# EAGLE board Arm Board (EAGLE 6.5.0)
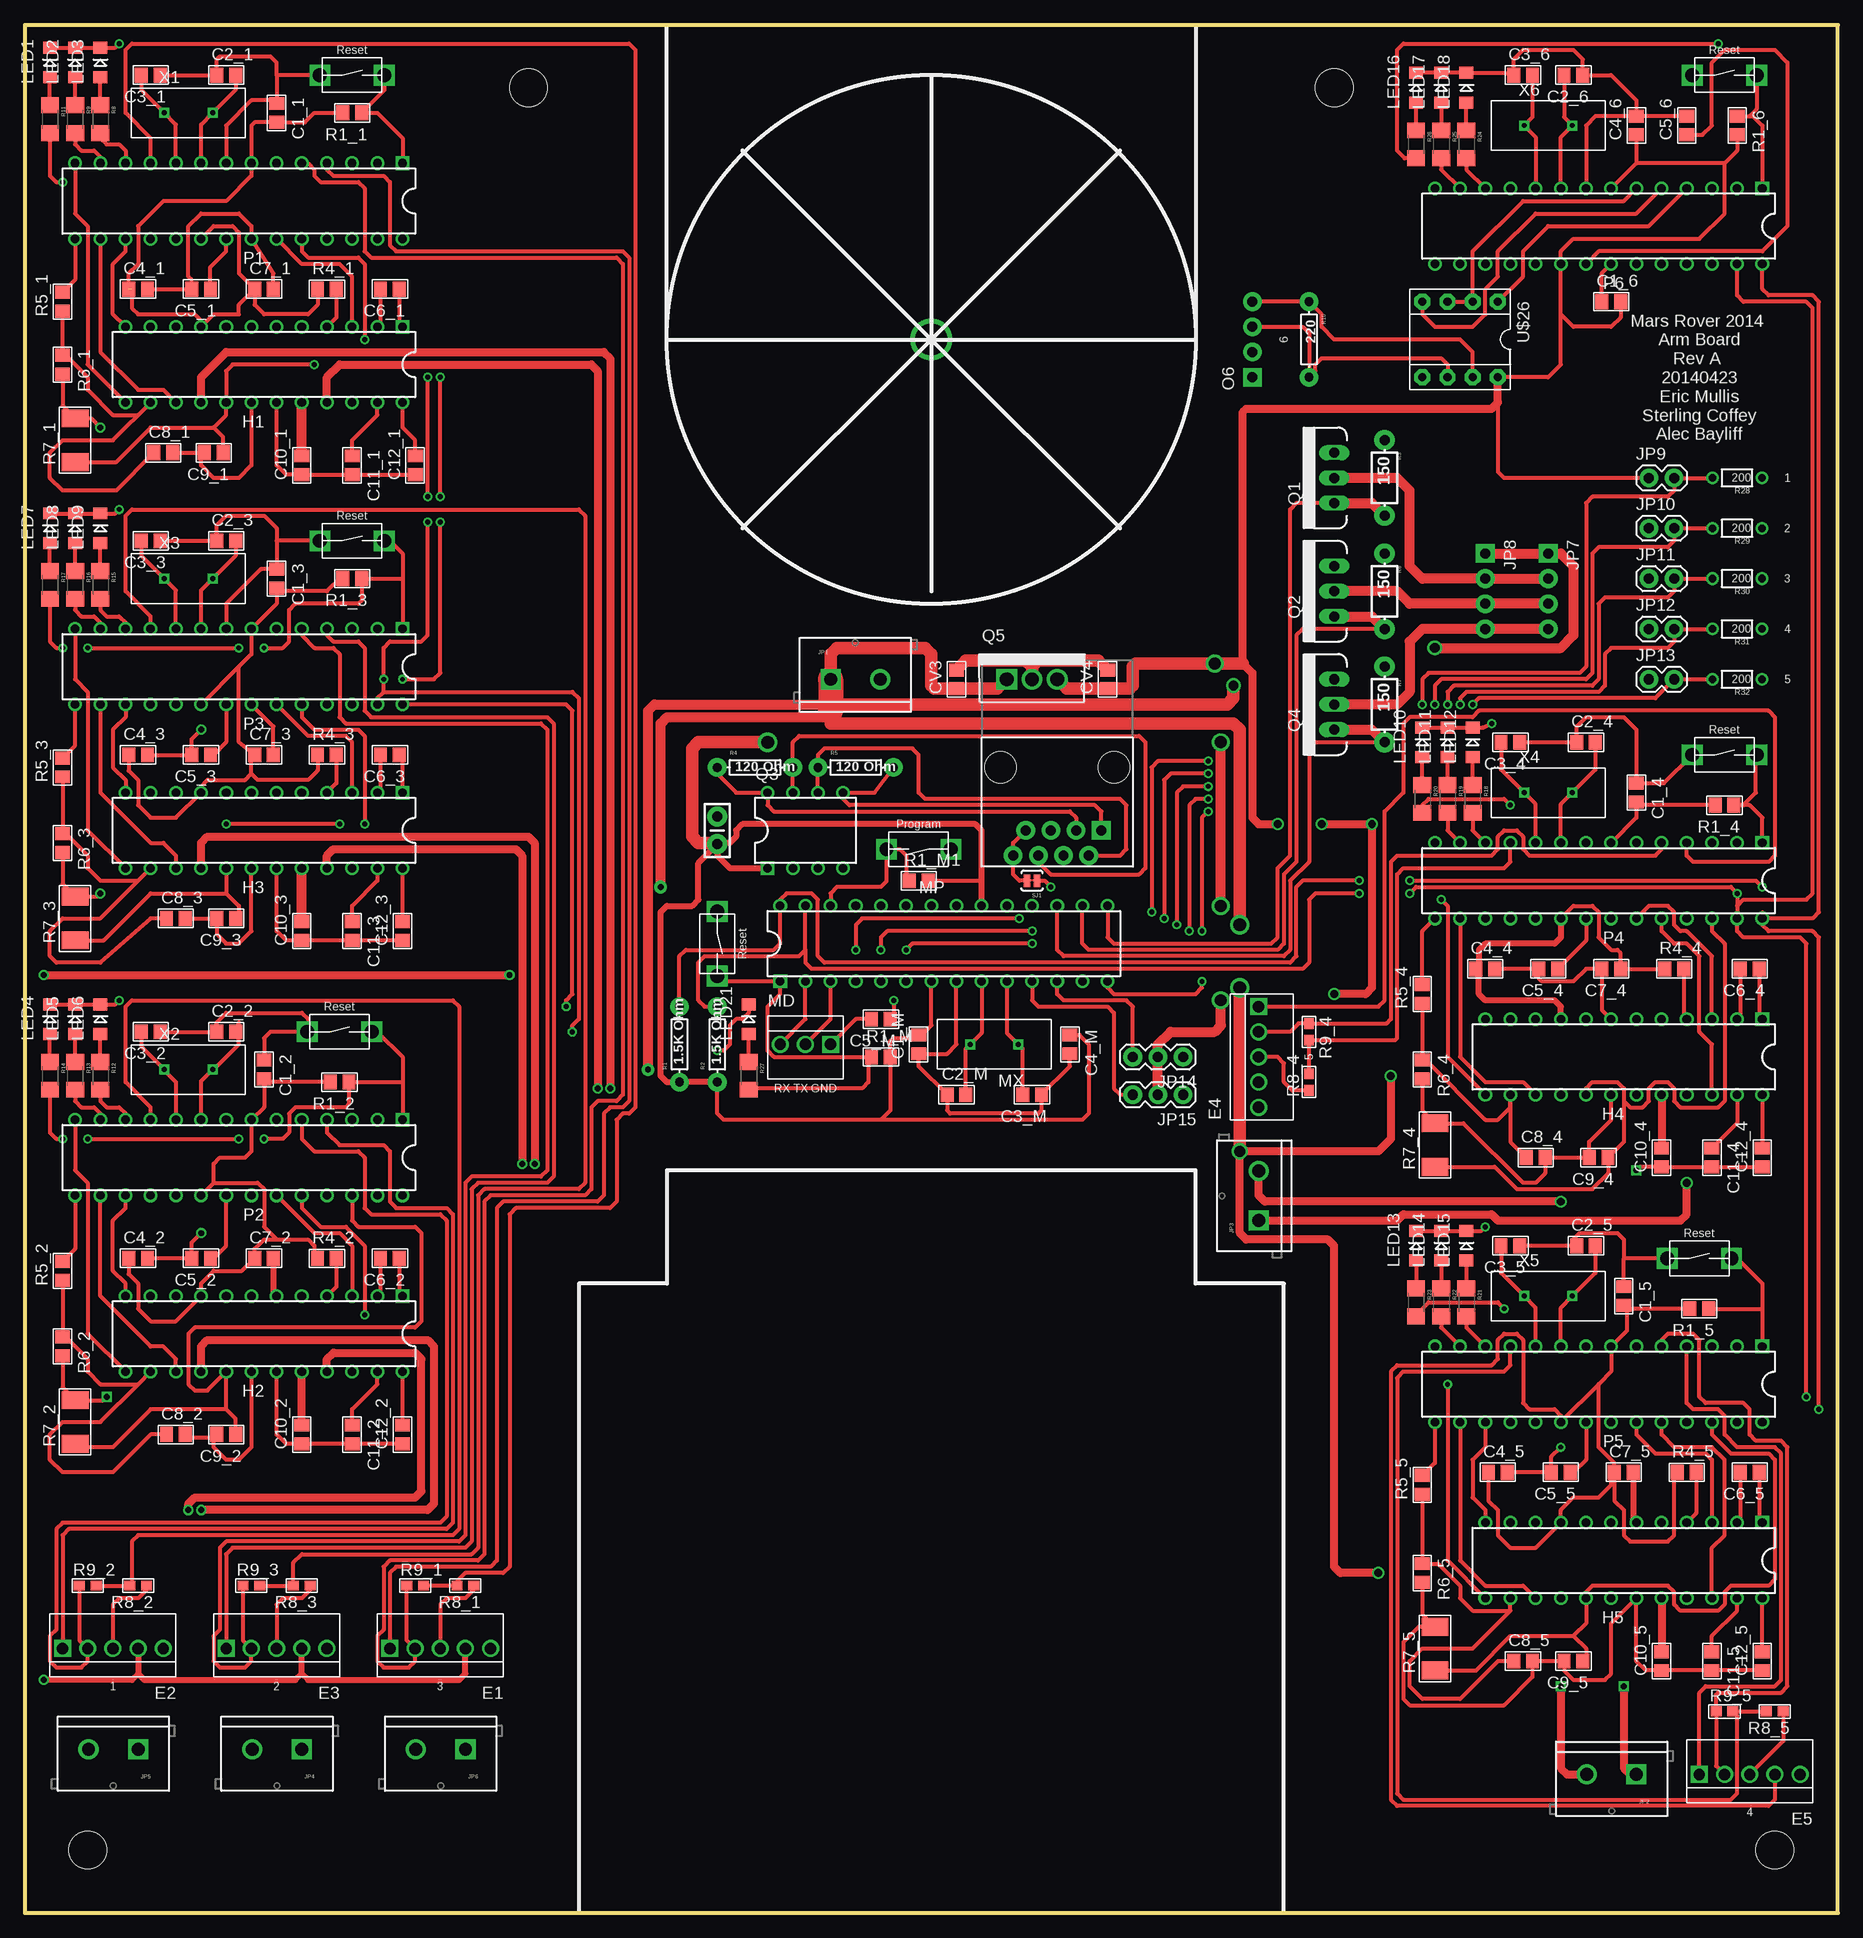
[diagram p8: board, top side]
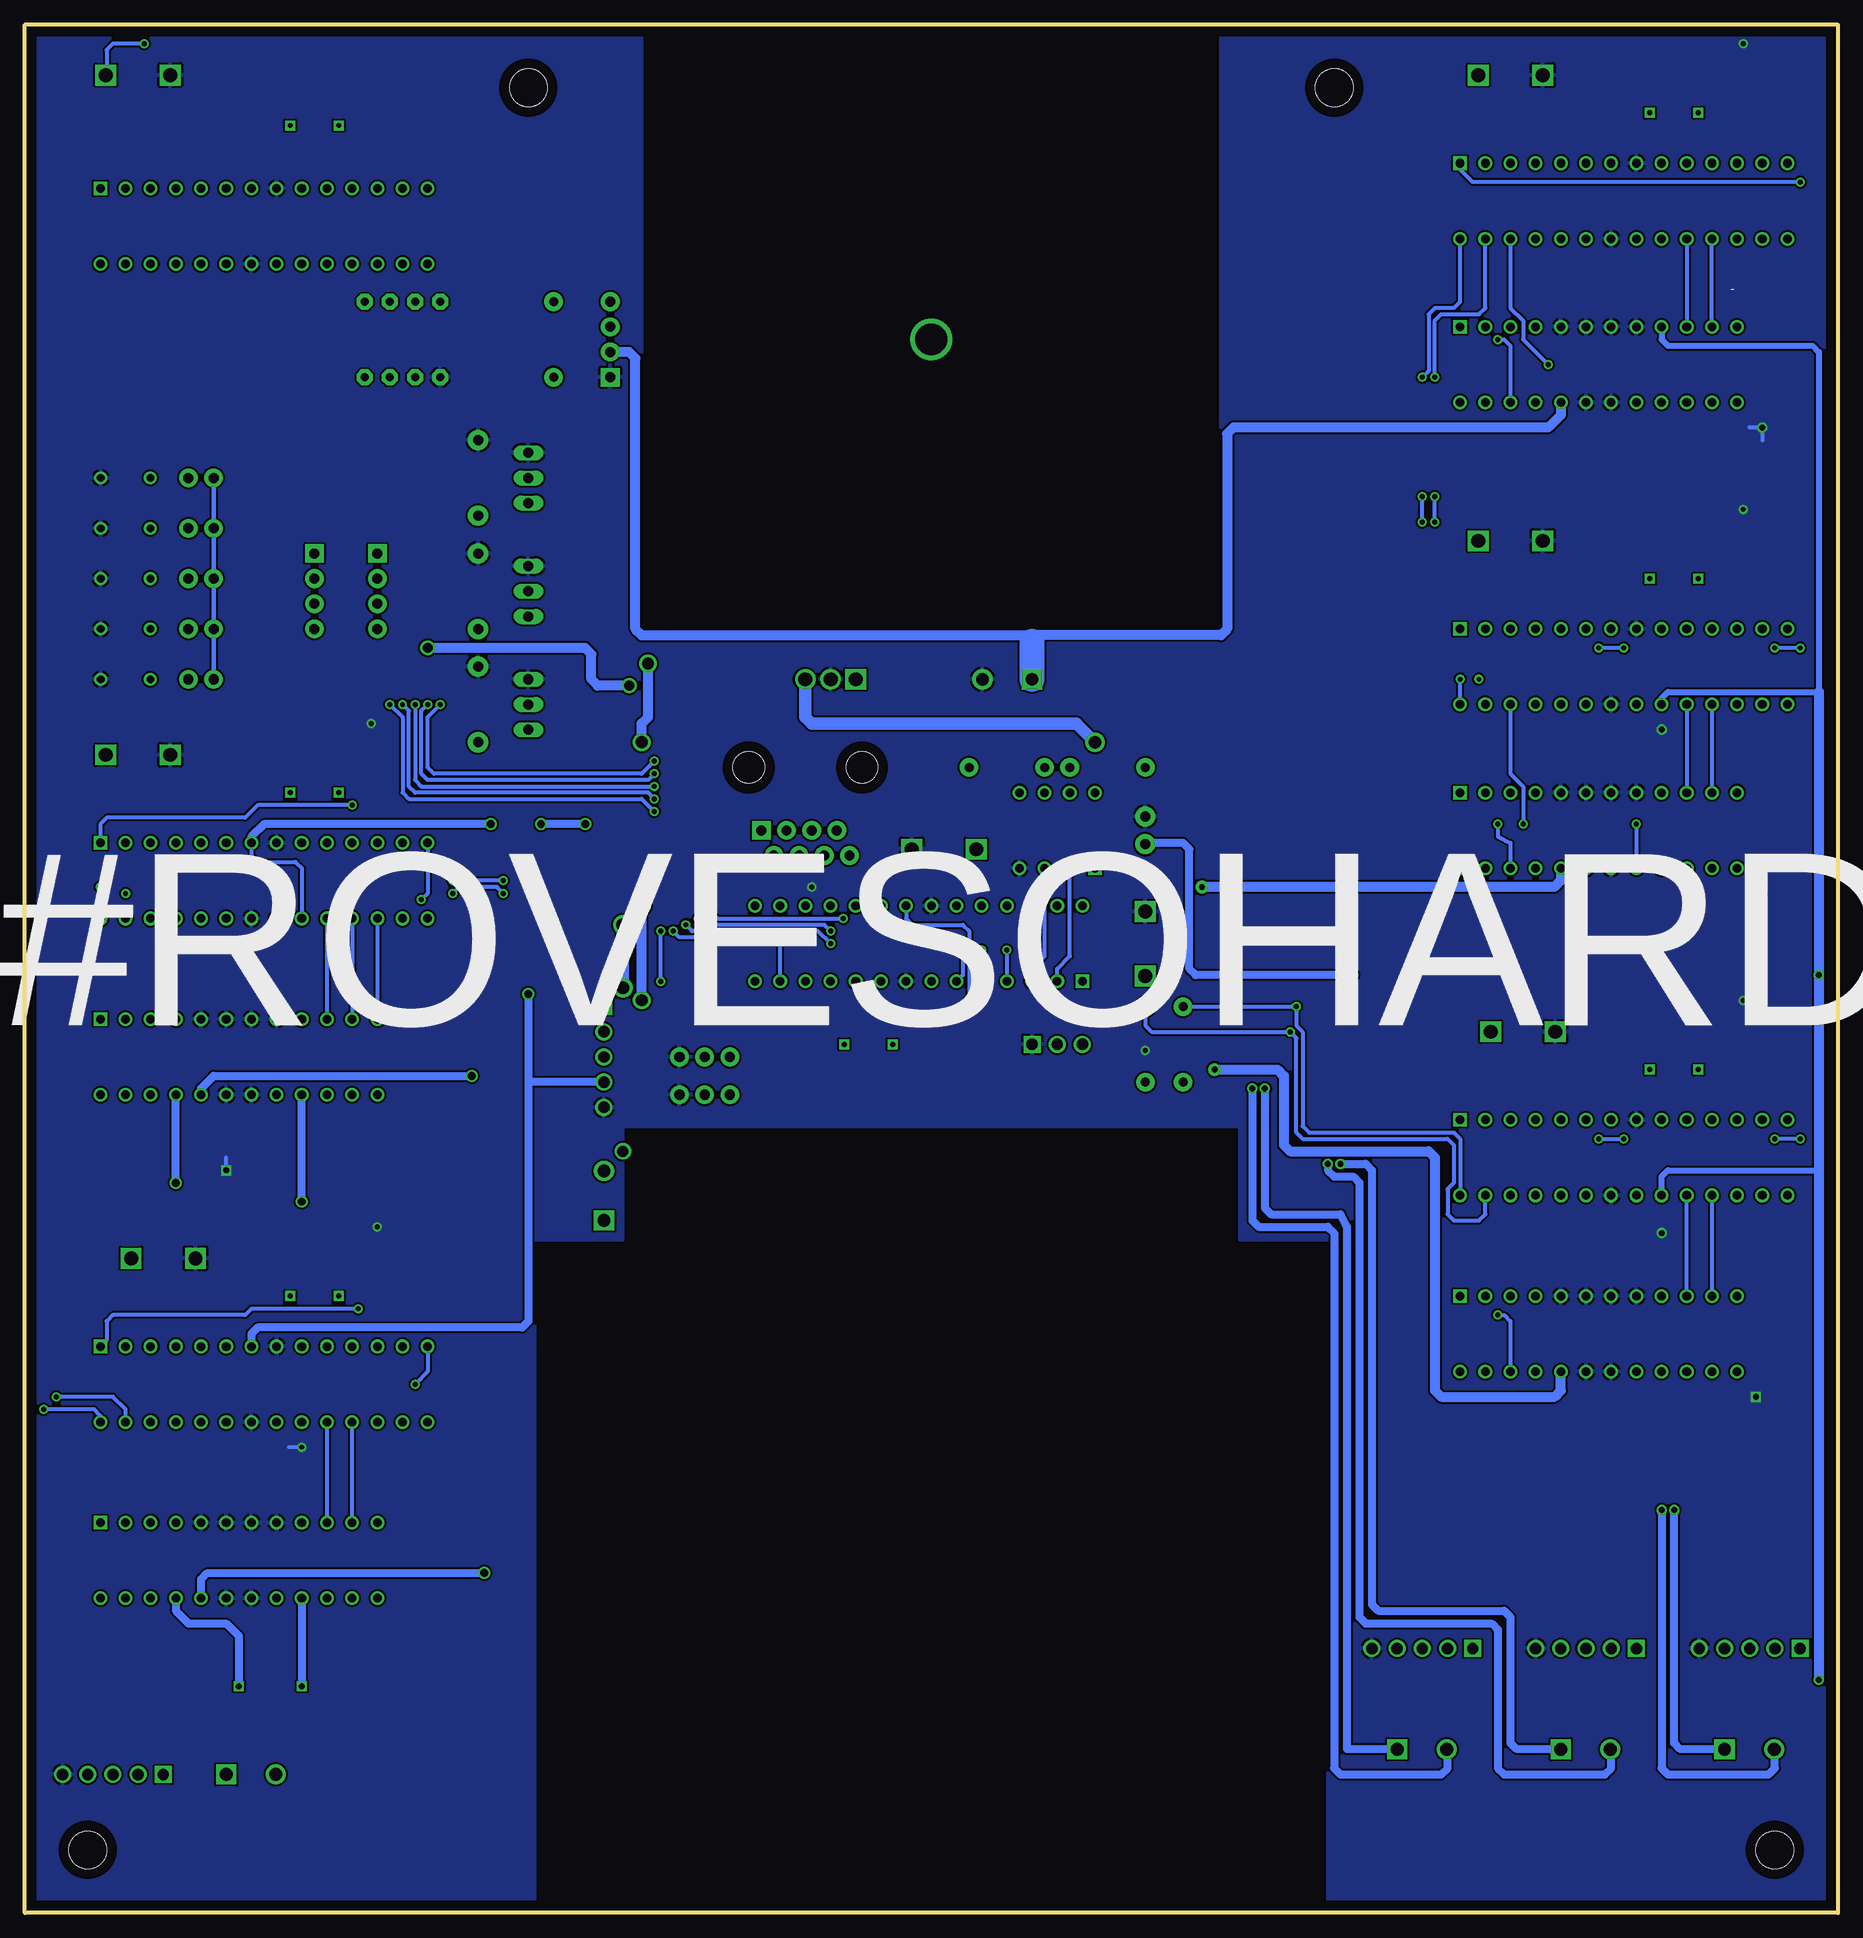
[diagram p9: board, bottom side, seen from below]

Size 182.88 x 190.5 mm. Coordinates in mm from the lower left corner, seen from the top.
Outline: 182.88,0 182.88,190.5 0,190.5 0,0 182.88,0
Copper layers (1*16): Top 0.035mm / dielectric 1.5mm / Bottom 0.035mm
Design rules "default *": minimum track width 10mil, minimum drill 15mil, track to track 8mil, track to pad 8mil, pad to pad 8mil, via to via 8mil, smd to smd 8mil, copper to edge 40mil, drill to drill 8mil, minimum pad ring 10mil, minimum via ring 8mil, stop-mask expansion 4mil, vias tented up to drill 0mil, thermal gap 10mil
Holes 3.81 mm at 50.8,184.15 132.08,184.15 176.53,6.35 6.35,6.35

## Footprints (pad centres in the part's own frame; a part is rotated, then mirrored left to right if it is on the bottom)
C_0805 = smd 1.3 x 1.5: 1 -0.95,0; 2 0.95,0
CAP-PTH-SMALL-KIT = drill 1.016 pad 2.032: 1 -1.397,0; 2 1.397,0
J_MTA100_5P = drill 1.143 square: 1 5.08,0 | drill 1.143: 2 2.54,0; 3 0,0; 4 -2.54,0; 5 -5.08,0
DIP24 = drill 0.864 square: 1 -16.51,-3.81 | drill 0.864: 2 -13.97,-3.81; 3 -11.43,-3.81; 4 -8.89,-3.81; 5 -6.35,-3.81; 6 -3.81,-3.81; 7 -1.27,-3.81; 8 1.27,-3.81; 9 3.81,-3.81; 10 6.35,-3.81; 11 8.89,-3.81; 12 11.43,-3.81; 13 11.43,3.81; 14 8.89,3.81; 15 6.35,3.81; 16 3.81,3.81; 17 1.27,3.81; 18 -1.27,3.81; 19 -3.81,3.81; 20 -6.35,3.81; 21 -8.89,3.81; 22 -11.43,3.81; 23 -13.97,3.81; 24 -16.51,3.81
J_TOGGLE = drill 1.4 square: P$1 -3.25,0; P$2 3.25,0
SCREWTERMINAL-5MM-2 = drill 1.3 pad 2.032 square: 1 0,0 | drill 1.3 pad 2.032: 2 5,0
1X04_NO_SILK = drill 1.016 pad 1.88 square: 1 0,0 | drill 1.016 pad 1.88: 2 2.54,0; 3 5.08,0; 4 7.62,0
1X02 = drill 1.016 pad 1.88: 1 0,0; 2 2.54,0
1X03 = drill 1.016 pad 1.88: 1 0,0; 2 2.54,0; 3 5.08,0
LED-1206 = smd 1.2 x 1.4: A -1.5,0; C 1.5,0
J_MTA100_3P = drill 1.143 square: 1 2.54,0 | drill 1.143: 2 0,0; 3 -2.54,0
DIP28 = drill 0.864 square: 1 -16.51,-3.81 | drill 0.864: 2 -13.97,-3.81; 3 -11.43,-3.81; 4 -8.89,-3.81; 5 -6.35,-3.81; 6 -3.81,-3.81; 7 -1.27,-3.81; 8 1.27,-3.81; 9 3.81,-3.81; 10 6.35,-3.81; 11 8.89,-3.81; 12 11.43,-3.81; 13 13.97,-3.81; 14 16.51,-3.81; 15 16.51,3.81; 16 13.97,3.81; 17 11.43,3.81; 18 8.89,3.81; 19 6.35,3.81; 20 3.81,3.81; 21 1.27,3.81; 22 -1.27,3.81; 23 -3.81,3.81; 24 -6.35,3.81; 25 -8.89,3.81; 26 -11.43,3.81; 27 -13.97,3.81; 28 -16.51,3.81
HC-49 = drill 0.5 square: P$1 -2.44,0; P$2 2.44,0
TO220V = drill 1.016 long: 1 -2.54,0; 2 0,0; 3 2.54,0
DIP8 = drill 0.864 square: 1 -3.81,-3.81 | drill 0.864: 2 -1.27,-3.81; 3 1.27,-3.81; 4 3.81,-3.81; 5 3.81,3.81; 6 1.27,3.81; 7 -1.27,3.81; 8 -3.81,3.81
TO-220 = drill 1.397 square: 1 -2.54,0 | drill 1.397: 2 0,0; 3 2.54,0
AXIAL-0.3 = drill 0.9 pad 1.88: P$1 -3.81,0; P$2 3.81,0
R_0805 = smd 1.3 x 1.5: 1 -0.95,0; 2 0.95,0
AXIAL-0.3-KIT = drill 1.016 pad 2.032: P$1 -3.81,0; P$2 3.81,0
R_2010 = smd 1.8 x 2.7: 1 -2.2,0; 2 2.2,0
1206 = smd 1.6 x 1.8: 1 -1.4,0; 2 1.4,0
R_0603 = smd 1.1 x 1: 1 -0.85,0; 2 0.85,0
AXIAL-0.3EZ = drill 0.9 pad 1.88: P$1 -3.81,0; P$2 3.81,0
1/6W-RES = drill 0.762: 1 -2.5,0; 2 2.5,0
SJ_2S-TRACE = smd 0.635 x 1.27: 1 -0.508,0; 2 0.508,0
RJ45-8 = drill 1 pad 1.88 square: 1 -4.445,6.35 | drill 1 pad 1.88: 2 -3.175,8.89; 3 -1.905,6.35; 4 -0.635,8.89; 5 0.635,6.35; 6 1.905,8.89; 7 3.175,6.35; 8 4.445,8.89 | hole 3.2: -5.715,0; 5.715,0
DIL08 = drill 0.813 pad 1.6 octagon: 1 -3.81,-3.81; 2 -1.27,-3.81; 3 1.27,-3.81; 4 3.81,-3.81; 5 3.81,3.81; 6 1.27,3.81; 7 -1.27,3.81; 8 -3.81,3.81

## Placement (x,y rotation side)
C1_1  .1uF  [C_0805]  25.4,181.61 270 top
C1_2  .1uF  [C_0805]  24.13,85.09 270 top
C1_3  .1uF  [C_0805]  25.4,134.62 270 top
C1_4  .1uF  [C_0805]  162.56,113.03 270 top
C1_5  .1uF  [C_0805]  161.29,62.23 270 top
C1_6  .1uF  [C_0805]  160.02,162.56 0 top
C1_M  .1uF  [C_0805]  90.17,87.63 90 top
C2_1  15pF  [C_0805]  20.32,185.42 0 top
C2_2  15pF  [C_0805]  20.32,88.9 0 top
C2_3  15pF  [C_0805]  20.32,138.43 0 top
C2_4  15pF  [C_0805]  157.48,118.11 0 top
C2_5  15pF  [C_0805]  157.48,67.31 0 top
C2_6  15pF  [C_0805]  156.21,185.42 180 top
C2_M  15pF  [C_0805]  93.98,82.55 0 top
C3_1  15pF  [C_0805]  12.7,185.42 180 top
C3_2  15pF  [C_0805]  12.7,88.9 180 top
C3_3  15pF  [C_0805]  12.7,138.43 180 top
C3_4  15pF  [C_0805]  149.86,118.11 180 top
C3_5  15pF  [C_0805]  149.86,67.31 180 top
C3_6  15pF  [C_0805]  151.13,185.42 0 top
C3_M  15pF  [C_0805]  101.6,82.55 180 top
C4_1  .1uF  [C_0805]  11.43,163.83 0 top
C4_2  .1uF  [C_0805]  11.43,66.04 0 top
C4_3  .1uF  [C_0805]  11.43,116.84 0 top
C4_4  .1uF  [C_0805]  147.32,95.25 0 top
C4_5  .1uF  [C_0805]  148.59,44.45 0 top
C4_6  .1uF  [C_0805]  162.56,180.34 90 top
C4_M  .1uF  [C_0805]  105.41,87.63 270 top
C5_1  .1uF  [C_0805]  17.78,163.83 180 top
C5_2  .1uF  [C_0805]  17.78,66.04 180 top
C5_3  .1uF  [C_0805]  17.78,116.84 180 top
C5_4  .1uF  [C_0805]  153.67,95.25 180 top
C5_5  .1uF  [C_0805]  154.94,44.45 180 top
C5_6  .1uF  [C_0805]  167.64,180.34 90 top
C5_M  .1uF  [C_0805]  86.36,90.17 180 top
C6_1  0.22uF  [C_0805]  36.83,163.83 180 top
C6_2  0.22uF  [C_0805]  36.83,66.04 180 top
C6_3  0.22uF  [C_0805]  36.83,116.84 180 top
C6_4  0.22uF  [C_0805]  173.99,95.25 180 top
C6_5  0.22uF  [C_0805]  173.99,44.45 180 top
C7_1  .1uF  [C_0805]  24.13,163.83 0 top
C7_2  .1uF  [C_0805]  24.13,66.04 0 top
C7_3  .1uF  [C_0805]  24.13,116.84 0 top
C7_4  .1uF  [C_0805]  160.02,95.25 180 top
C7_5  .1uF  [C_0805]  161.29,44.45 0 top
C8_1  .1uF  [C_0805]  13.97,147.32 0 top
C8_2  .1uF  [C_0805]  15.24,48.26 0 top
C8_3  .1uF  [C_0805]  15.24,100.33 0 top
C8_4  .1uF  [C_0805]  152.4,76.2 0 top
C8_5  .1uF  [C_0805]  151.13,25.4 0 top
C9_1  [C_0805]  19.05,147.32 180 top
C9_2  [C_0805]  20.32,48.26 180 top
C9_3  [C_0805]  20.32,100.33 180 top
C9_4  [C_0805]  158.75,76.2 180 top
C9_5  [C_0805]  156.21,25.4 180 top
C10  .1uF  [CAP-PTH-SMALL-KIT]  69.85,109.22 90 top
C10_1  1uF  [C_0805]  27.94,146.05 90 top
C10_2  1uF  [C_0805]  27.94,48.26 90 top
C10_3  1uF  [C_0805]  27.94,99.06 90 top
C10_4  1uF  [C_0805]  165.1,76.2 90 top
C10_5  1uF  [C_0805]  165.1,25.4 90 top
C11_1  .22uF  [C_0805]  33.02,146.05 270 top
C11_2  .22uF  [C_0805]  33.02,48.26 270 top
C11_3  .22uF  [C_0805]  33.02,99.06 270 top
C11_4  .22uF  [C_0805]  170.18,76.2 270 top
C11_5  .22uF  [C_0805]  170.18,25.4 270 top
C12_1  .22uF  [C_0805]  39.37,146.05 90 top
C12_2  .22uF  [C_0805]  38.1,48.26 90 top
C12_3  .22uF  [C_0805]  38.1,99.06 90 top
C12_4  .22uF  [C_0805]  175.26,76.2 90 top
C12_5  .22uF  [C_0805]  175.26,25.4 90 top
CV3  .1uF  [C_0805]  93.98,124.46 90 top
CV4  .1uF  [C_0805]  109.22,124.46 90 top
E1  [J_MTA100_5P]  41.91,26.67 180 top
E2  [J_MTA100_5P]  8.89,26.67 180 top
E3  [J_MTA100_5P]  25.4,26.67 180 top
E4  [J_MTA100_5P]  124.46,86.36 90 top
E5  [J_MTA100_5P]  173.99,13.97 180 top
H1  A3959  [DIP24]  21.59,156.21 180 top
H2  A3959  [DIP24]  21.59,58.42 180 top
H3  A3959  [DIP24]  21.59,109.22 180 top
H4  A3959  [DIP24]  158.75,86.36 180 top
H5  A3959  [DIP24]  158.75,35.56 180 top
J6  J_MC32857  [J_TOGGLE]  171.45,185.42 0 top
JP1  M025MM  [SCREWTERMINAL-5MM-2]  81.28,124.46 0 top
JP2  M025MM  [SCREWTERMINAL-5MM-2]  162.56,13.97 180 top
JP3  M025MM  [SCREWTERMINAL-5MM-2]  124.46,69.85 90 top
JP4  M025MM  [SCREWTERMINAL-5MM-2]  27.94,16.51 180 top
JP5  M025MM  [SCREWTERMINAL-5MM-2]  11.43,16.51 180 top
JP6  M025MM  [SCREWTERMINAL-5MM-2]  44.45,16.51 180 top
JP7  [1X04_NO_SILK]  153.67,137.16 270 top
JP8  [1X04_NO_SILK]  147.32,137.16 270 top
JP9  M02PTH  [1X02]  163.83,144.78 0 top
JP10  M02PTH  [1X02]  163.83,139.7 0 top
JP11  M02PTH  [1X02]  163.83,134.62 0 top
JP12  M02PTH  [1X02]  163.83,129.54 0 top
JP13  M02PTH  [1X02]  163.83,124.46 0 top
JP14  [1X03]  116.84,86.36 180 top
JP15  [1X03]  116.84,82.55 180 top
LED1  [LED-1206]  2.54,186.69 90 top
LED2  [LED-1206]  5.08,186.69 90 top
LED3  [LED-1206]  7.62,186.69 90 top
LED4  [LED-1206]  2.54,90.17 90 top
LED5  [LED-1206]  5.08,90.17 90 top
LED6  [LED-1206]  7.62,90.17 90 top
LED7  [LED-1206]  2.54,139.7 90 top
LED8  [LED-1206]  5.08,139.7 90 top
LED9  [LED-1206]  7.62,139.7 90 top
LED10  [LED-1206]  140.97,118.11 90 top
LED11  [LED-1206]  143.51,118.11 90 top
LED12  [LED-1206]  146.05,118.11 90 top
LED13  [LED-1206]  140.34,67.31 90 top
LED14  [LED-1206]  142.88,67.31 90 top
LED15  [LED-1206]  145.41,67.31 90 top
LED16  [LED-1206]  140.34,184.15 90 top
LED17  [LED-1206]  142.88,184.15 90 top
LED18  [LED-1206]  145.41,184.15 90 top
LED21  [LED-1206]  73.03,90.17 90 top
MD  [J_MTA100_3P]  78.74,87.63 0 top
MP  ATMEGA328P  [DIP28]  92.71,97.79 0 top
MS  J_MC32857  [J_TOGGLE]  69.85,97.79 270 top
MS1  J_MC32857  [J_TOGGLE]  90.17,107.31 180 top
MX  HC49S  [HC-49]  97.79,87.63 180 top
O6  [1X04_NO_SILK]  123.83,154.94 90 top
P1  ATMEGA328P  [DIP28]  21.59,172.72 180 top
P2  ATMEGA328P  [DIP28]  21.59,76.2 180 top
P3  ATMEGA328P  [DIP28]  21.59,125.73 180 top
P4  ATMEGA328P  [DIP28]  158.75,104.14 180 top
P5  ATMEGA328P  [DIP28]  158.75,53.34 180 top
P6  ATMEGA328P  [DIP28]  158.75,170.18 180 top
Q1  MOSFET-NCHANNELFQP30N06L  [TO220V]  132.08,144.78 90 top
Q2  MOSFET-NCHANNELFQP30N06L  [TO220V]  132.08,133.35 90 top
Q3  Q_LTC490  [DIP8]  78.74,109.22 0 top
Q4  MOSFET-NCHANNELFQP30N06L  [TO220V]  132.08,121.92 90 top
Q5  LDO  [TO-220]  101.6,124.46 0 top
R1  1.5K Ohm  [AXIAL-0.3]  66.04,87.63 90 top
R1_1  200  [R_0805]  33.02,181.61 180 top
R1_2  200  [R_0805]  31.75,83.82 180 top
R1_3  200  [R_0805]  33.02,134.62 180 top
R1_4  200  [R_0805]  171.45,111.76 180 top
R1_5  200  [R_0805]  168.91,60.96 180 top
R1_6  200  [R_0805]  172.72,180.34 270 top
R1_M  200  [R_0805]  86.36,86.36 0 top
R1_M1  200  [R_0805]  90.17,104.14 0 top
R2  1.5K Ohm  [AXIAL-0.3]  69.85,87.63 90 top
R3  150  [AXIAL-0.3-KIT]  137.16,144.78 270 top
R4  120 Ohm  [AXIAL-0.3]  73.66,115.57 0 top
R4_1  51k  [R_0805]  30.48,163.83 0 top
R4_2  51k  [R_0805]  30.48,66.04 0 top
R4_3  51k  [R_0805]  30.48,116.84 0 top
R4_4  51k  [R_0805]  166.37,95.25 0 top
R4_5  51k  [R_0805]  167.64,44.45 0 top
R5  120 Ohm  [AXIAL-0.3]  83.82,115.57 0 top
R5_1  1k  [R_0805]  3.81,162.56 90 top
R5_2  1k  [R_0805]  3.81,64.77 90 top
R5_3  1k  [R_0805]  3.81,115.57 90 top
R5_4  1k  [R_0805]  140.97,92.71 90 top
R5_5  1k  [R_0805]  140.97,43.18 90 top
R6  150  [AXIAL-0.3-KIT]  137.16,133.35 270 top
R6_1  10k  [R_0805]  3.81,156.21 270 top
R6_2  10k  [R_0805]  3.81,57.15 270 top
R6_3  10k  [R_0805]  3.81,107.95 270 top
R6_4  10k  [R_0805]  140.97,85.09 270 top
R6_5  10k  [R_0805]  140.97,34.29 270 top
R7  150  [AXIAL-0.3-KIT]  137.16,121.92 270 top
R7_1  .1  [R_2010]  5.08,148.59 90 top
R7_2  [R_2010]  5.08,49.53 90 top
R7_3  [R_2010]  5.08,100.33 90 top
R7_4  [R_2010]  142.24,77.47 90 top
R7_5  [R_2010]  142.24,26.67 90 top
R8  120  [1206]  7.62,180.97 270 top
R8_1  0  [R_0603]  44.45,33.02 180 top
R8_2  0  [R_0603]  11.43,33.02 180 top
R8_3  0  [R_0603]  27.94,33.02 180 top
R8_4  0  [R_0603]  129.54,83.82 90 top
R8_5  0  [R_0603]  176.53,20.32 180 top
R9  120  [1206]  5.08,180.97 270 top
R9_1  0  [R_0603]  39.37,33.02 0 top
R9_2  0  [R_0603]  6.35,33.02 0 top
R9_3  0  [R_0603]  22.86,33.02 0 top
R9_4  0  [R_0603]  129.54,88.9 270 top
R9_5  0  [R_0603]  171.45,20.32 0 top
R10  220  [AXIAL-0.3EZ]  129.54,158.75 270 top
R11  120  [1206]  2.54,180.97 270 top
R12  120  [1206]  7.62,84.45 270 top
R13  120  [1206]  5.08,84.45 270 top
R14  120  [1206]  2.54,84.45 270 top
R15  120  [1206]  7.62,133.99 270 top
R16  120  [1206]  5.08,133.99 270 top
R17  120  [1206]  2.54,133.99 270 top
R18  120  [1206]  146.05,112.39 270 top
R19  120  [1206]  143.51,112.39 270 top
R20  120  [1206]  140.97,112.39 270 top
R21  120  [1206]  145.41,61.59 270 top
R22  120  [1206]  142.88,61.59 270 top
R23  120  [1206]  140.34,61.59 270 top
R24  120  [1206]  145.41,178.44 270 top
R25  120  [1206]  142.88,178.44 270 top
R26  120  [1206]  140.34,178.44 270 top
R27  120  [1206]  73.03,84.45 270 top
R28  200  [1/6W-RES]  172.72,144.78 180 top
R29  200  [1/6W-RES]  172.72,139.7 180 top
R30  200  [1/6W-RES]  172.72,134.62 180 top
R31  200  [1/6W-RES]  172.72,129.54 180 top
R32  200  [1/6W-RES]  172.72,124.46 180 top
S1  J_MC32857  [J_TOGGLE]  33.02,185.42 0 top
S2  J_MC32857  [J_TOGGLE]  31.75,88.9 0 top
S3  J_MC32857  [J_TOGGLE]  33.02,138.43 0 top
S4  J_MC32857  [J_TOGGLE]  171.45,116.84 0 top
S5  J_MC32857  [J_TOGGLE]  168.91,66.04 0 top
SJ1  SOLDERJUMPERTRACE  [SJ_2S-TRACE]  101.6,104.14 180 top
U$2  RJ45-8PTH  [RJ45-8]  104.14,115.57 180 top
U$26  MAX485DIL  [DIL08]  144.78,158.75 180 top
X1  HC49S  [HC-49]  16.51,181.61 0 top
X2  HC49S  [HC-49]  16.51,85.09 0 top
X3  HC49S  [HC-49]  16.51,134.62 0 top
X4  HC49S  [HC-49]  153.67,113.03 0 top
X5  HC49S  [HC-49]  153.67,62.23 0 top
X6  HC49S  [HC-49]  153.67,180.34 0 top

## Tracks (layer width: path | path; a pad name or v marks a point on that pad's centre or on a via)
B1  (via drill 0.5)
  Top 0.406: R28.2 JP9.2 166.37,143.51 165.74,142.88 158.12,142.88 157.48,142.24 157.48,125.73 156.84,125.09 141.6,125.09 140.97,124.46 v140.97,121.92 | v119.38,116.2 114.3,116.2 113.67,115.57 v113.67,100.97 | v100.33,100.33 84.45,100.33 83.82,99.69 v83.82,97.16
  Bottom 0.406: v83.82,97.16 MP.4 | v119.38,116.2 120.65,114.94 141.6,114.94 142.24,115.57 142.24,120.65 v140.97,121.92 | v113.67,100.97 113.03,100.33 v100.33,100.33
B2  (via drill 0.5)
  Top 0.406: R29.2 JP10.2 166.37,138.43 165.74,137.79 158.75,137.79 158.12,137.16 158.12,125.09 157.48,124.46 142.88,124.46 142.24,123.83 v142.24,121.92 | v119.38,114.94 115.57,114.94 114.94,114.3 v114.94,100.33 | v101.6,99.06 87,99.06 86.36,98.42 v86.36,97.16
  Bottom 0.406: v119.38,114.94 120.02,114.3 142.24,114.3 142.88,114.94 142.88,121.28 v142.24,121.92 | v101.6,99.06 102.23,99.69 114.3,99.69 v114.94,100.33 | v86.36,97.16 87,96.52 87,94.61 MP.5
B3  (via drill 0.5)
  Top 0.406: R30.2 JP11.2 166.37,133.35 165.74,132.72 159.38,132.72 158.75,132.08 158.75,124.46 158.12,123.83 144.15,123.83 143.51,123.19 v143.51,121.92 | v119.38,113.67 116.84,113.67 116.2,113.03 v116.2,99.69 | v101.6,97.79 89.53,97.79 v88.9,97.16
  Bottom 0.406: v143.51,121.92 143.51,114.3 142.88,113.67 v119.38,113.67 | v101.6,97.79 102.87,99.06 115.57,99.06 v116.2,99.69 | v88.9,97.16 88.27,96.52 88.27,94.61 MP.6
B4  (via drill 0.5)
  Top 0.406: R31.2 JP12.2 166.37,128.27 165.74,127.64 160.02,127.64 159.38,127 159.38,123.83 158.75,123.19 145.41,123.19 144.78,122.56 v144.78,121.92 | v119.38,112.39 118.11,112.39 117.47,111.76 v117.47,99.06
  Bottom 0.406: v119.38,112.39 120.02,113.03 143.51,113.03 144.15,113.67 144.15,121.28 v144.78,121.92 | v117.47,99.06 116.84,98.42 107.31,98.42 106.68,97.79 MP.13
B5  (via drill 0.5)
  Top 0.406: R32.2 JP13.2 164.47,122.56 146.69,122.56 v146.05,121.92 | v119.38,111.12 118.75,110.49 v118.75,99.06 | v118.75,93.98 118.75,93.34 118.11,92.71 109.86,92.71 109.22,93.34 MP.14
  Bottom 0.406: v146.05,121.92 144.78,120.65 144.78,113.03 144.15,112.39 120.65,112.39 v119.38,111.12 | v118.75,93.98 v118.75,99.06
BLANK1
  Top 0.406: H1.12 8.89,161.29 8.89,166.37 10.16,167.64 P1.17
BLANK2
  Top 0.406: H2.12 10.16,63.5 8.89,64.77 8.89,69.85 10.16,71.12 P2.17
BLANK3
  Top 0.406: P3.17 10.16,120.65 8.89,119.38 8.89,115.57 10.16,114.3 H3.12
BLANK4
  Bottom 0.406: P4.17 H4.12
BLANK5
  Top 0.406: P5.17 147.32,46.99 146.05,45.72 146.05,41.91 147.32,40.64 H5.12
D+
  Top 0.406: O6.3 128.91,160.02 129.54,159.38 R10.P$2 130.18,155.57 130.18,156.21 130.81,156.84 142.88,156.84 143.51,156.21 U$26.6
D-
  Top 0.406: O6.4 R10.P$1 130.81,161.29 130.81,160.02 132.08,158.75 144.78,158.75 146.05,157.48 U$26.7
DIR6
  Top 0.406: U$26.3 U$26.2 146.05,167.64 151.13,172.72 161.29,172.72 P6.6
DM
  Top 0.406: MD.2 81.28,90.17 MP.3
  Bottom 0.406: MP.3 81.28,95.25 80.01,96.52 Q3.3
EN1
  Bottom 0.406: P1.19 H1.10
EN2
  Bottom 0.406: H2.10 P2.19
EN3
  Bottom 0.406: P3.19 H3.10
EN4
  Bottom 0.406: P4.19 H4.10
EN5
  Bottom 0.406: P5.19 H5.10
EXTMODE1
  Top 0.406: P1.16 7.62,157.48 11.43,153.67 13.97,153.67 H1.15
EXTMODE2
  Top 0.406: H2.15 15.24,55.88 13.97,57.15 12.7,57.15 7.62,62.23 P2.16
EXTMODE3
  Top 0.406: P3.16 7.62,113.03 12.7,107.95 13.97,107.95 15.24,106.68 H3.15
EXTMODE4
  Top 0.406: P4.16 144.78,86.36 147.32,83.82 151.13,83.82 H4.15
EXTMODE5
  Top 0.406: P5.16 144.78,35.56 147.32,33.02 151.13,33.02 H5.15
GND  (via drill 0.5, 0.6, 0.6 pad 0.25)
  Top 0.406: MP.8 93.98,87.63 93.03,86.68 C1_M.1 90.17,85.41 C2_M.1 93.03,80.96 93.34,80.64 102.23,80.64 102.55,80.96 C3_M.1 105.41,85.41 C4_M.2 105.73,86.36 | C5_M.2 83.82,90.17 MD.1 | C4_6.2 158.43,181.29 157.48,180.34 P6.8 | C4_6.2 162.56,182.88 160.02,185.42 C2_6.1 157.16,187.01 156.21,187.96 151.13,187.96 150.18,187.01 C3_6.1 149.31,185.65 LED18.C LED17.C LED16.C | C1_6.1 159.07,165.42 P6.22 | C5_6.2 C4_6.2 | C3_1.1 C2_1.1 19.37,187.01 19.68,187.32 24.77,187.32 25.4,186.69 25.4,185.42 | C1_1.1 25.4,182.88 | S1.P$1 25.4,185.42 | 25.4,185.42 25.4,182.88 | 25.4,182.88 22.86,182.88 20.32,180.34 P1.8 | C4_1.2 C5_1.2 16.83,164.78 16.51,165.1 16.51,170.18 17.78,171.45 21.59,171.45 22.86,170.18 P1.22 25.08,165.42 C7_1.2 | C8_1.2 C9_1.2 17.78,147 17.78,146.05 19.05,144.78 21.59,144.78 22.86,146.05 H1.18 | H1.19 25.4,146.05 26.35,145.1 C10_1.1 C11_1.2 C12_1.1 | C3_3.1 C2_3.1 19.37,140.02 20.32,140.97 24.13,140.97 25.4,139.7 25.4,138.43 | P3.8 20.32,132.08 23.81,135.57 C1_3.1 25.4,138.43 | S3.P$1 25.4,138.43 | H3.18 22.86,99.06 21.59,97.79 20.32,97.79 19.37,98.74 C9_3.2 C8_3.2 | C12_3.1 C11_3.2 C10_3.1 26.35,98.11 25.4,99.06 H3.19 | C4_3.2 C5_3.2 16.83,118.43 v17.78,119.38 | C7_3.2 25.08,119.7 P3.22 | C3_2.1 C2_2.1 19.37,89.86 20.32,90.81 27.94,90.81 28.57,90.17 28.57,88.97 S2.P$1 24.77,88.9 24.13,88.27 C1_2.1 | C12_2.1 C11_2.2 C10_2.1 26.35,47.31 25.4,48.26 H2.19 | H2.18 22.86,46.99 21.59,45.72 20.32,45.72 19.05,46.99 19.05,47.94 | 19.05,47.94 C9_2.2 | C4_2.2 C5_2.2 16.83,67.63 v17.78,68.58 | v7.62,149.86 6.69,150.79 R7_1.2 3.81,152.06 R6_1.2 | v7.62,102.87 7.28,102.53 R7_3.2 3.81,103.8 R6_3.2
  Top 0.406: 19.05,47.94 16.51,47.94 C8_2.2 | C3_5.1 C2_5.1 156.21,67.63 156.21,67.94 156.84,68.58 160.66,68.58 161.29,67.94 161.29,66.04 | C1_5.1 161.29,66.04 | S5.P$1 161.29,66.04 | R6_5.2 140.97,30.14 R7_5.2 140.63,28.87 139.06,27.3 139.06,21.59 139.7,20.95 149.22,20.95 152.08,23.81 C8_5.2 C9_5.2 155.26,24.45 156.21,23.5 159.38,23.5 160.02,24.13 160.02,29.21 H5.19 162.56,25.4 163.51,24.45 C10_5.1 C11_5.2 C12_5.1 | C4_5.2 C5_5.2 153.99,46.04 v154.94,46.99 | S4.P$1 165.34,113.98 C1_4.1 162.56,119.38 161.29,120.65 157.48,120.65 156.53,119.7 C2_4.1 C3_4.1 | R6_4.2 140.97,80.94 R7_4.2 145.12,79.67 151.13,73.66 152.4,73.66 153.35,74.61 C8_4.2 C9_4.2 157.8,77.79 160.02,80.01 H4.18 | H4.7 159.07,91.12 C7_4.2 157.48,95.25 156.21,93.98 153.03,93.98 152.4,94.61 152.4,94.93 C5_4.2 C4_4.2 | C12_4.1 C11_4.2 C10_4.1 162.88,75.25 v162.56,74.93 | R6_2.2 3.81,53 R7_2.2 7.92,51.73 v8.26,52.07 | SJ1.1 102.87,104.14 v103.5,103.5 | LED1.C LED2.C LED3.C 9.12,188.19 v9.53,188.59 | LED4.C LED5.C LED6.C 9.12,91.67 v9.53,92.08 | LED7.C LED8.C LED9.C 9.12,141.2 v9.53,141.6 | LED10.C LED11.C LED12.C 147.09,119.61 v147.96,120.02 | LED13.C LED14.C LED15.C 146.91,68.81 v147.32,69.22 | LED21.C 73.03,90.81 72.39,90.17 71.75,90.17 71.12,89.53 71.12,87.63 70.48,87 v69.85,87
  Top 0.61: C7_5.2 162.24,39.69 H5.6 | C7_2.2 25.08,62.55 H2.6
  Top 1.27: Q5.2 101.6,125.73 | 101.6,125.73 102.23,126.36 108.27,126.36 CV4.2 | CV3.2 94.94,126.36 100.97,126.36 101.6,125.73
  Bottom 0.406: 7.62,148.59 v7.62,149.86 8.89,149.86 | v154.94,46.99 156.21,46.99 | v162.56,74.93 162.56,76.2
  pour Bottom: 0,0 0,190.5 62.23,190.5 62.23,129.54 120.65,129.54 120.65,190.5 182.88,190.5 182.88,0 131.44,0 131.44,67.94 122.56,67.94 122.56,79.38 60.33,79.38 60.33,67.94 51.44,67.94 51.44,0
INTERRUPT1_1
  Top 0.406: R9_1.1 38.52,27.52 E1.2 39.37,25.4 38.73,24.77 36.2,24.77 35.56,25.4 35.56,27.94 36.2,28.57 36.2,34.92 36.83,35.56 45.72,35.56 46.35,36.2 46.35,71.75 46.99,72.39 56.52,72.39 57.15,73.03 57.15,81.28 57.78,81.92 59.69,81.92 60.33,82.55 60.33,166.37 59.69,167 34.92,167 34.29,167.64 34.29,173.99 33.66,174.62 29.84,174.62 29.21,175.26 29.21,175.9 28.57,176.53 P1.5
INTERRUPT1_2
  Top 0.406: P2.5 27.94,78.11 29.21,76.83 33.66,76.83 34.29,76.2 34.29,71.12 34.92,70.48 41.91,70.48 42.55,69.85 42.55,40.01 41.91,39.37 3.81,39.37 3.17,38.73 3.17,28.57 2.54,27.94 2.54,25.4 3.17,24.77 5.71,24.77 6.35,25.4 E2.2 5.5,27.52 R9_2.1
INTERRUPT1_3
  Top 0.406: R9_3.1 22.01,27.52 E3.2 22.86,25.4 22.23,24.77 19.68,24.77 19.05,25.4 19.05,27.94 19.68,28.57 19.68,36.83 20.32,37.47 43.81,37.47 44.45,38.1 44.45,73.66 45.09,74.3 52.07,74.3 52.7,74.93 52.7,119.38 52.07,120.02 32.38,120.02 31.75,120.65 31.75,127 31.11,127.64 29.21,127.64 27.94,128.91 P3.5
INTERRUPT1_4
  Top 0.406: P4.5 165.1,107.31 164.47,106.68 151.76,106.68 151.13,107.31 151.13,108.58 150.5,109.22 149.22,109.22 148.59,108.58 148.59,107.31 147.96,106.68 138.43,106.68 137.79,106.05 137.79,90.17 137.38,89.75 R9_4.1 128.49,89.75 127.64,88.9 E4.2
INTERRUPT1_5
  Top 0.406: E5.2 170.6,14.82 R9_5.1 170.6,22.01 170.81,22.23 177.16,22.23 177.8,22.86 177.8,46.99 177.16,47.62 174.62,47.62 173.99,48.26 173.99,50.8 173.35,51.44 169.54,51.44 168.91,52.07 168.91,57.78 168.28,58.42 165.74,58.42 165.1,57.78 P5.5
INTERRUPT2_1
  Top 0.406: P1.4 30.48,175.9 31.11,175.26 36.2,175.26 36.83,174.62 36.83,168.28 37.47,167.64 60.33,167.64 60.96,167 60.96,81.92 60.33,81.28 59.05,81.28 58.42,80.64 58.42,72.39 57.78,71.75 48.26,71.75 47.62,71.12 47.62,35.56 46.99,34.92 37.47,34.92 36.83,34.29 E1.1
INTERRUPT2_2
  Top 0.406: P2.4 30.48,78.74 31.75,77.47 36.2,77.47 36.83,76.83 36.83,71.75 37.47,71.12 42.55,71.12 43.18,70.48 43.18,39.37 42.55,38.73 4.45,38.73 3.81,38.1 E2.1
INTERRUPT2_3
  Top 0.406: P3.4 30.48,128.91 31.11,128.27 33.66,128.27 34.29,127.64 34.29,121.28 34.92,120.65 52.7,120.65 53.34,120.02 53.34,74.3 52.7,73.66 45.72,73.66 45.09,73.03 45.09,37.47 44.45,36.83 20.95,36.83 20.32,36.2 E3.1
INTERRUPT2_4
  Top 0.406: E4.1 136.53,91.44 137.16,92.08 137.16,111.12 139.06,113.03 139.06,120.02 139.7,120.65 146.05,120.65 146.69,121.28 175.9,121.28 176.53,120.65 176.53,106.68 175.9,106.05 168.28,106.05 167.64,106.68 P4.4
INTERRUPT2_5
  Top 0.406: E5.1 168.91,22.23 169.54,22.86 176.53,22.86 177.16,23.5 177.16,46.35 176.53,46.99 172.72,46.99 171.45,48.26 171.45,50.16 170.81,50.8 168.28,50.8 167.64,51.44 P5.4
ISENSE1  (via drill 0.5)
  Top 0.406: R7_1.1 9.23,146.39 12.7,149.86 19.05,149.86 | 19.05,149.86 20.32,151.13 H1.17 20.32,155.57 20.95,156.21 v29.21,156.21 | C9_1.1 20,148.91 19.05,149.86
  Bottom 0.406: P1.26 33.02,161.93 31.75,160.66 31.75,158.75 v29.21,156.21
ISENSE2
  Top 0.254: 5.08,46.99 R7_2.1
  Top 0.406: C9_2.1 21.27,49.85 20.32,50.8 | 20.32,50.8 H2.17 18.41,52.7 17.14,52.7 16.51,53.34 16.51,58.42 17.14,59.05 39.37,59.05 40.01,59.69 40.01,68.58 39.37,69.22 33.66,69.22 33.02,69.85 P2.26 | 20.32,50.8 12.7,50.8 8.89,46.99 5.08,46.99
ISENSE3  (via drill 0.5)
  Top 0.406: R7_3.1 7.96,98.13 12.7,102.87 20.32,102.87 | 20.32,102.87 21.59,101.6 21.59,100.65 C9_3.1 | H3.17 20.32,102.87 | v31.75,109.86 v20.32,109.86
  Bottom 0.406: P3.26 33.02,114.94 31.75,113.67 v31.75,109.86 | v20.32,109.86 H3.17
ISENSE4
  Top 0.406: R7_4.1 148.25,75.27 150.5,73.03 158.12,73.03 159.7,74.61 C9_4.1 161.29,77.79 161.29,81.92 | P4.26 170.18,99.06 171.45,97.79 171.45,81.92 170.81,81.28 167,81.28 166.37,81.92 166.37,83.19 165.74,83.82 164.47,83.82 163.83,83.19 163.83,81.92 163.19,81.28 161.93,81.28 161.29,81.92 | H4.17 157.48,83.19 158.12,83.82 160.66,83.82 161.29,83.19 161.29,81.92
ISENSE5
  Top 0.406: R7_5.1 146.39,24.47 149.86,27.94 156.21,27.94 | 156.21,27.94 157.48,26.67 157.48,25.72 C9_5.1 | 156.21,27.94 157.48,29.21 H5.17 157.48,32.38 158.12,33.02 165.74,33.02 166.37,32.38 166.37,31.11 167,30.48 170.81,30.48 171.45,31.11 171.45,32.38 172.09,33.02 175.9,33.02 176.53,33.66 176.53,45.72 175.9,46.35 172.09,46.35 170.18,48.26 P5.26
LED1_1
  Top 0.406: R8.2 7.62,179.07 8.26,178.44 9.53,178.44 10.16,177.8 P1.12
LED1_2
  Top 0.406: R12.2 7.62,81.92 8.26,81.28 9.53,81.28 10.16,80.64 P2.12
LED1_3
  Top 0.406: R15.2 7.62,131.44 8.26,130.81 9.53,130.81 10.16,130.18 P3.12
LED1_4
  Top 0.406: R18.2 146.05,109.22 P4.12
LED1_5
  Top 0.406: R21.2 145.41,59.05 P5.12
LED1_6
  Top 0.406: R24.2 145.41,175.9 P6.12
LED2_1
  Top 0.406: R9.2 5.08,178.44 5.71,177.8 6.99,177.8 7.62,177.16 P1.13
LED2_2
  Top 0.406: R13.2 5.08,81.92 5.71,81.28 6.99,81.28 7.62,80.64 P2.13
LED2_3
  Top 0.406: R16.2 5.08,131.44 5.71,130.81 6.99,130.81 7.62,130.18 P3.13
LED2_4
  Top 0.406: R19.2 143.51,109.22 P4.13
LED2_5
  Top 0.406: R22.2 142.88,59.05 P5.13
LED2_6
  Top 0.406: R25.2 142.88,175.9 P6.13
N$1  (via drill 3.2)
  other vias: 91.44,158.75
N$2
  Top 0.406: U$2.3 106.05,110.49 105.41,111.12 75.56,111.12 74.93,111.76 Q3.8 71.75,113.03 69.85,114.94 R4.P$1
N$3
  Top 0.406: R8.1 LED3.A
N$4
  Top 0.406: R9.1 LED2.A
N$5
  Top 0.406: R5.P$2 85.72,113.03 Q3.5 82.55,112.39 83.19,111.76 107.95,111.76 108.58,111.12 U$2.1
N$6
  Top 0.406: R11.1 LED1.A
N$7
  Top 0.406: R12.1 LED6.A
N$8
  Top 0.406: SJ1.2 100.33,104.14 99.69,104.78 U$2.8 99.69,107.95 U$2.7
N$9
  Top 0.406: U$2.2 110.49,106.68 111.12,107.31 111.12,111.76 110.49,112.39 90.81,112.39 90.17,113.03 90.17,116.84 89.53,117.47 80.64,117.47 80.01,116.84 R5.P$1 Q3.6
N$10
  Top 0.406: U$2.6 102.23,106.05 103.5,104.78 112.39,104.78 113.03,105.41 113.03,118.11 112.39,118.75 78.11,118.75 77.47,118.11 Q3.7 R4.P$2
N$11
  Top 0.406: C3_1.2 11.75,183.93 X1.P$1 15.24,180.44 P1.10
N$12
  Top 0.406: C2_1.2 21.27,183.93 X1.P$2 17.78,180.44 P1.9
N$13
  Top 0.406: R13.1 LED5.A
N$14
  Top 0.406: C5_1.1 18.73,166.05 20.32,167.64 P1.21
N$15  (via drill 0.5)
  Top 0.406: S1.P$2 36.27,183.91 R1_1.1 35.56,181.61 38.1,179.07 P1.1 | R11.2 2.54,175.26 3.17,174.62 v3.81,174.62
  Bottom 0.406: v3.81,174.62 36.83,174.62 38.1,175.9 P1.1
N$16
  Top 0.406: C6_1.1 37.78,160.34 H1.1
N$17
  Top 0.406: C6_1.2 35.88,160.34 H1.2
N$18
  Top 0.406: R4_1.2 31.43,160.97 H1.4
N$19
  Top 0.406: R14.1 LED4.A
N$20
  Top 0.406: C12_1.2 39.37,148.59 38.1,149.86 H1.24
N$21
  Top 0.406: R15.1 LED9.A
N$22
  Top 0.406: C11_1.1 33.02,148.59 35.56,151.13 H1.23
N$23
  Top 0.406: R16.1 LED8.A
N$24
  Top 0.406: R17.1 LED7.A
N$25
  Top 0.406: R18.1 LED12.A
N$26
  Top 0.406: R8_1.1 45.3,32.6 44.45,31.75 42.55,31.75 41.91,31.11 E1.3
N$27
  Top 0.406: C3_2.2 11.75,87.41 X2.P$1 14.07,84.99 15.24,83.82 P2.10
N$28
  Top 0.406: C2_2.2 21.59,89.85 21.59,87.63 19.15,85.19 19.05,85.19 X2.P$2 17.78,83.92 P2.9
N$29
  Top 0.406: C5_2.1 19.05,66.04 20.32,67.31 P2.21
N$30  (via drill 0.5)
  Top 0.406: S2.P$2 35.56,88.9 38.1,86.36 38.1,83.82 | 38.1,83.82 P2.1 | 38.1,83.82 R1_2.1 32.7,81.59 32.38,81.28 27.3,81.28 26.67,80.64 26.67,78.74 26.04,78.11 v24.13,78.11 | R14.2 2.54,78.74 3.17,78.11 v3.81,78.11 | v6.35,78.11 v21.59,78.11
  Bottom 0.406: v3.81,78.11 v6.35,78.11 | v24.13,78.11 v21.59,78.11
N$31
  Top 0.406: C6_2.1 37.78,62.55 H2.1
N$32
  Top 0.406: C6_2.2 35.88,62.55 H2.2
N$33
  Top 0.406: R4_2.2 31.43,63.18 H2.4
N$34
  Top 0.406: C12_2.2 H2.24
N$35
  Top 0.406: C11_2.1 33.02,50.8 35.56,53.34 H2.23
N$36
  Top 0.406: R19.1 LED11.A
N$37
  Top 0.406: R20.1 LED10.A
N$38
  Top 0.406: LED15.A R21.1
N$39
  Top 0.406: R8_2.1 12.28,32.6 11.43,31.75 9.53,31.75 8.89,31.11 E2.3
N$40
  Top 0.406: C3_3.2 11.75,136.94 X3.P$1 15.24,133.45 P3.10
N$41
  Top 0.406: C2_3.2 21.27,136.94 X3.P$2 17.78,133.45 P3.9
N$42
  Top 0.254: 19.05,116.84 C5_3.1
  Top 0.406: P3.21 20.32,118.11 19.05,116.84
N$43  (via drill 0.5)
  Top 0.406: S3.P$2 36.83,138.43 38.1,137.16 38.1,134.62 | 38.1,134.62 P3.1 | 38.1,134.62 R1_3.1 33.97,132.4 33.66,132.08 27.3,132.08 26.67,131.44 26.67,128.27 26.04,127.64 v24.13,127.64 | R17.2 2.54,128.27 3.17,127.64 v3.81,127.64 | v6.35,127.64 v21.59,127.64
  Bottom 0.406: v3.81,127.64 v6.35,127.64 | v21.59,127.64 v24.13,127.64
N$44
  Top 0.406: H3.1 38.1,116.52 C6_3.1
N$45
  Top 0.406: C6_3.2 35.88,113.35 H3.2
N$46
  Top 0.406: R4_3.2 31.43,113.98 H3.4
N$47
  Top 0.406: C12_3.2 H3.24
N$48
  Top 0.406: C11_3.1 33.02,101.6 35.56,104.14 H3.23
N$49
  Top 0.406: LED14.A R22.1
N$50
  Top 0.406: LED13.A R23.1
N$51
  Top 0.406: R24.1 LED18.A
N$52
  Top 0.406: R8_3.1 28.79,32.6 27.94,31.75 26.04,31.75 25.4,31.11 E3.3
N$53
  Top 0.406: C3_4.2 148.91,115.35 X4.P$1 152.4,111.86 P4.10
N$54
  Top 0.406: C2_4.2 158.43,115.35 X4.P$2 154.94,111.86 P4.9
N$55
  Top 0.406: P4.21 157.48,98.11 C5_4.1
N$56  (via drill 0.5)
  Top 0.406: P4.1 175.26,110.49 173.99,111.76 R1_4.1 173.35,111.76 174.62,113.03 174.62,116.77 S4.P$2 | R20.2 140.97,111.76 141.6,112.39 149.22,112.39 v149.86,111.76
  Bottom 0.406: v149.86,111.76 159.38,111.76 160.66,110.49 174.62,110.49 175.26,109.86 P4.1
N$57
  Top 0.406: C6_4.1 174.94,90.49 H4.1
N$58
  Top 0.406: C6_4.2 173.04,90.49 H4.2
N$59
  Top 0.406: R4_4.2 167.32,90.49 H4.4
N$60
  Top 0.406: H4.24 C12_4.2
N$61
  Top 0.406: H4.23 172.72,79.69 C11_4.1
N$62
  Top 0.406: LED17.A R25.1
N$63
  Top 0.406: R26.1 LED16.A
N$64
  Top 0.406: R27.1 LED21.A
N$65
  Top 0.406: R8_4.1 127.85,82.97 127,83.82 127,85.72 126.36,86.36 E4.3
N$66
  Top 0.406: P5.10 152.4,61.06 X5.P$1 148.91,64.55 C3_5.2
N$67
  Top 0.406: C2_5.2 158.43,64.55 X5.P$2 154.94,61.06 P5.9
N$68
  Top 0.254: 156.21,44.45 C5_5.1
  Top 0.406: P5.21 157.48,45.72 156.21,44.45
N$69  (via drill 0.5)
  Top 0.406: S5.P$2 172.72,66.04 175.26,63.5 175.26,60.96 | 175.26,60.96 P5.1 | R1_5.1 175.26,60.96 | R23.2 140.34,60.33 141.6,61.59 148.59,61.59 v149.22,60.96
  Bottom 0.406: v149.22,60.96 160.02,60.96 160.66,60.33 173.99,60.33 174.62,59.69 174.62,57.78 P5.1
N$70
  Top 0.406: C6_5.1 174.94,39.69 H5.1
N$71
  Top 0.406: C6_5.2 173.04,39.69 H5.2
N$72
  Top 0.406: R4_5.2 168.59,40.32 H5.4
N$73
  Top 0.406: C12_5.2 H5.24
N$74
  Top 0.406: C11_5.1 170.18,27.94 172.72,30.48 H5.23
N$75
  Top 0.406: R1_M1.1 88.9,104.46 88.9,106.68 88.27,107.31 MS1.P$2 86.92,104.06 86.36,103.5 81.92,103.5 81.28,102.87 MP.26
N$78
  Top 0.406: R8_5.1 177.38,17.36 E5.3
N$79
  Top 0.406: P6.10 152.4,179.17 X6.P$1 152.08,181.19 C3_6.2
N$80
  Top 0.406: P6.9 154.94,179.17 X6.P$2 155.26,181.19 C2_6.2
N$81
  Top 0.406: C5_6.1 169.23,179.39 170.18,180.34 170.18,186.69 171.45,187.96 176.53,187.96 177.8,186.69 177.8,170.18 175.26,167.64 158.75,167.64 P6.21
N$85
  Top 0.406: MP.10 99.06,88.8 MX.P$1 100.65,87.21 C3_M.2
N$86
  Top 0.406: MP.9 96.52,88.8 MX.P$2 94.93,87.21 C2_M.2
N$87  (via drill 0.5)
  Top 0.406: v87.63,92.08 87.63,90.49 C5_M.1
  Bottom 0.406: MP.21 93.98,100.33 93.34,99.69 88.27,99.69 87.63,99.06 v87.63,92.08
N$88
  Top 0.406: R1_M.1 85.09,86.36 | MS.P$2 70.41,93.98 MP.1 76.2,92.71 74.93,91.44 74.93,87 75.56,86.36 85.09,86.36 | 85.09,86.36 85.09,83.82 84.45,83.19 73.16,83.19 R27.2
O1
  Top 1.016: JP7.2 JP8.2 140.97,134.62 139.7,135.89 139.7,143.51 138.43,144.78 Q1.2
O2
  Top 1.016: JP7.3 JP8.3 139.7,132.08 138.43,133.35 Q2.2
O3
  Top 1.016: JP7.4 JP8.4 140.97,129.54 139.7,128.27 139.7,123.19 138.43,121.92 Q4.2
OUTA1  (via drill 0.6 pad 1.02)
  Top 0.813: H1.16 17.78,154.94 20.32,157.48 58.42,157.48 59.05,156.84 v59.05,83.19
  Bottom 0.813: v59.05,83.19 59.05,69.85 58.42,69.22 51.44,69.22 50.8,68.58 50.8,14.61 50.16,13.97 40.01,13.97 39.37,14.61 39.37,16.43 JP6.2
OUTA2  (via drill 0.6 pad 1.02)
  Top 0.813: H2.16 17.78,57.15 18.41,57.78 40.64,57.78 41.27,57.15 41.27,41.27 40.64,40.64 v17.78,40.64
  Bottom 0.813: v17.78,40.64 17.78,14.61 17.14,13.97 6.99,13.97 6.35,14.61 6.35,16.43 JP5.2
OUTA3  (via drill 0.6 pad 1.02)
  Top 0.813: H3.16 17.78,107.95 18.41,108.58 50.8,108.58 51.44,107.95 v51.44,75.56
  Bottom 0.813: v51.44,75.56 51.44,74.93 50.8,74.3 48.9,74.3 48.26,73.66 48.26,29.84 47.62,29.21 34.92,29.21 34.29,28.57 34.29,14.61 33.66,13.97 23.5,13.97 22.86,14.61 22.86,16.43 JP4.2
OUTA4  (via drill 0.8)
  Top 0.813: v154.94,71.75 125.09,71.75 124.46,72.39 JP3.2
  Bottom 0.813: v154.94,71.75 H4.16
OUTA5  (via drill 0.6)
  Top 0.813: v154.94,22.86 154.94,14.61 155.57,13.97 JP2.2
  Bottom 0.813: H5.16 v154.94,22.86
OUTB1  (via drill 0.6 pad 1.02)
  Top 0.813: H1.21 30.48,154.94 31.75,156.21 57.15,156.21 57.78,155.57 v57.78,83.19
  Bottom 0.813: v57.78,83.19 57.78,71.12 57.15,70.48 50.16,70.48 49.53,69.22 49.53,16.51 JP6.1
OUTB2  (via drill 0.6 pad 1.02)
  Top 0.813: H2.21 30.48,55.88 31.11,56.52 39.37,56.52 40.01,55.88 40.01,42.55 39.37,41.91 17.14,41.91 16.51,41.27 v16.51,40.64
  Bottom 0.813: v16.51,40.64 16.51,17.14 15.88,16.51 JP5.1
OUTB3  (via drill 0.6 pad 1.02)
  Top 0.813: H3.21 30.48,106.68 31.11,107.31 49.53,107.31 50.16,106.68 v50.16,75.56
  Bottom 0.813: v50.16,75.56 47.62,75.56 46.99,74.93 46.99,31.11 46.35,30.48 33.66,30.48 33.02,29.84 33.02,17.14 32.38,16.51 JP4.1
OUTB4  (via drill 0.8)
  Top 0.813: v167.64,73.66 167.64,70.48 167,69.85 148.59,69.85 147.96,70.48 139.06,70.48 138.43,69.85 JP3.1
  Bottom 0.813: v167.64,73.66 H4.21
OUTB5  (via drill 0.6)
  Top 0.813: v161.29,22.86 161.29,14.61 161.93,13.97 JP2.1
  Bottom 0.813: H5.21 167.64,30.48 166.37,29.21 162.56,29.21 161.29,27.94 v161.29,22.86
PFD1_1
  Top 0.406: P1.14 5.08,171.45 6.35,170.18 6.35,156.21 H1.13
PFD1_2
  Top 0.406: P2.14 5.08,74.93 6.35,73.66 6.35,58.42 H2.13
PFD1_3
  Top 0.406: P3.14 5.08,124.46 6.35,123.19 6.35,109.22 H3.13
PFD1_4  (via drill 0.5)
  Top 0.406: H4.13 143.51,86.36 143.51,101.6 v142.88,102.23
  Bottom 0.406: P4.14 142.24,102.87 v142.88,102.23
PFD1_5  (via drill 0.5)
  Top 0.406: H5.13 143.51,35.56 v143.51,53.34
  Bottom 0.406: P5.14 142.24,54.61 v143.51,53.34
PFD2_1
  Bottom 0.406: H1.11 P1.18
PFD2_2
  Bottom 0.406: P2.18 H2.11
PFD2_3
  Bottom 0.406: P3.18 H3.11
PFD2_4
  Bottom 0.406: P4.18 H4.11
PFD2_5
  Bottom 0.406: H5.11 P5.18
PHASE1
  Top 0.406: H1.3 33.02,165.1 31.75,166.37 27.94,166.37 P1.23
PHASE2
  Top 0.406: P2.23 29.21,68.58 31.75,68.58 33.02,67.31 H2.3
PHASE3
  Top 0.406: H3.3 33.02,118.11 32.38,118.75 28.57,118.75 P3.23
PHASE4
  Top 0.406: H4.3 170.18,96.52 167.64,99.06 167,99.06 166.37,99.69 166.37,100.97 165.74,101.6 163.83,101.6 P4.23
PHASE5
  Top 0.406: P5.23 162.56,48.26 164.47,46.35 169.54,46.35 170.18,45.72 H5.3
PULSE1
  Top 0.406: P1.11 12.7,179.07 10.16,181.61 10.16,187.96 10.79,188.59 60.96,188.59 61.59,187.96 61.59,81.28 60.96,80.64 60.33,80.64 59.69,80.01 59.69,71.75 59.05,71.12 49.53,71.12 48.9,70.48 48.9,34.92 48.26,34.29 44.45,34.29 43.18,33.02 R8_1.2 R9_1.2
PULSE2
  Top 0.406: P2.11 12.7,81.28 10.16,83.82 10.16,91.44 10.79,92.08 43.18,92.08 43.81,91.44 43.81,38.73 43.18,38.1 11.43,38.1 10.79,37.47 10.79,33.23 R8_2.2 R9_2.2
PULSE3
  Top 0.406: P3.11 12.7,130.81 10.16,133.35 10.16,140.97 10.79,141.6 55.88,141.6 56.52,140.97 56.52,73.66 55.88,73.03 46.35,73.03 45.72,72.39 45.72,36.83 45.09,36.2 27.94,36.2 27.09,35.34 R8_3.2 R9_3.2
PULSE4
  Top 0.406: R8_4.2 R9_4.2 138.22,88.05 138.43,88.27 138.43,104.78 139.06,105.41 149.22,105.41 149.86,106.05 P4.11
PULSE5
  Top 0.406: R8_5.2 R9_5.2 172.72,19.9 172.72,12.06 172.09,11.43 139.06,11.43 138.43,12.06 138.43,53.98 139.06,54.61 149.22,54.61 149.86,55.24 P5.11
PWM1
  Top 0.406: MP.11 101.6,92.08 102.23,91.44 109.22,91.44 109.86,90.81 109.86,83.19 110.49,82.55 JP15.3
PWM2
  Top 0.406: JP14.3 111.76,91.44 111.12,92.08 104.78,92.08 104.14,92.71 MP.12
REF1
  Top 0.406: R5_1.1 R6_1.1 4.13,157.16 6.35,154.94 6.35,153.67 8.89,151.13 11.43,151.13 H1.14 8.89,148.59 3.81,148.59 2.54,147.32 2.54,144.78 3.81,143.51 9.21,143.51 C8_1.1
REF1_1
  Top 0.406: P1.15 5.08,164.78 R5_1.2
REF1_2
  Top 0.406: P2.15 5.08,66.99 R5_2.2
REF1_3
  Top 0.406: R5_3.2 5.08,117.79 P3.15
REF1_4
  Top 0.406: R5_4.2 140.97,99.06 P4.15
REF1_5
  Top 0.406: P5.15 142.24,45.4 R5_5.2
REF2
  Top 0.406: R5_2.1 R6_2.1 4.13,58.1 6.35,55.88 6.35,54.61 7.62,53.34 11.43,53.34 | C8_2.1 12.7,48.26 8.89,44.45 3.81,44.45 2.54,45.72 2.54,48.26 3.81,49.53 7.62,49.53 11.43,53.34 | 11.43,53.34 H2.14
REF3
  Top 0.406: R5_3.1 3.81,109.22 | 3.81,109.22 R6_3.1 | C8_3.1 12.7,100.33 7.62,95.89 3.17,95.89 2.54,96.52 2.54,99.06 3.81,100.33 7.62,100.33 11.43,104.14 | 11.43,104.14 H3.14 | 3.81,109.22 6.35,106.68 6.35,105.41 7.62,104.14 11.43,104.14
REF4
  Top 0.406: R5_4.1 R6_4.1 141.29,86.04 147.32,80.01 148.59,80.01 149.86,81.28 H4.14 149.86,77.79 C8_4.1
REF5
  Top 0.406: R5_5.1 R6_5.1 142.56,35.24 144.78,33.02 144.78,31.75 146.05,30.48 149.86,30.48 | C8_5.1 148.59,25.4 144.78,21.59 140.97,21.59 139.7,22.86 139.7,25.4 140.97,26.67 146.05,26.67 149.86,30.48 | 149.86,30.48 H5.14
RM
  Top 0.406: MD.3 78.74,90.17 MP.2
  Bottom 0.406: MP.2 78.74,95.25 77.47,96.52 Q3.2
S1
  Top 0.406: Q1.1 128.27,142.24 127.64,141.6 127.64,106.68 126.36,105.41 126.36,98.42 125.73,97.79 109.86,97.79 109.22,98.42 MP.15
  Top 1.016: Q1.1 135.89,142.24 R3.P$2
S2
  Top 0.406: R6.P$2 128.91,129.54 128.27,128.91 128.27,106.05 127,104.78 127,97.79 126.36,97.16 107.31,97.16 106.68,97.79 MP.16
  Top 1.016: Q2.1 135.89,130.81 R6.P$2
S3
  Top 0.406: R7.P$2 130.18,118.11 129.54,117.47 129.54,106.05 127.64,104.14 127.64,97.16 127,96.52 104.78,96.52 104.14,97.16 MP.17
  Top 1.016: Q4.1 135.89,119.38 R7.P$2
S6  (via drill 0.5)
  Top 0.406: R1_6.1 173.99,181.29 | 173.99,181.29 174.31,181.29 175.26,180.34 P6.1 | J6.P$2 174.7,182 173.99,181.29 | R26.2 139.19,177.03 138.43,177.8 138.43,187.96 139.06,188.59 v170.81,188.59
  Bottom 0.406: v170.81,188.59 173.99,188.59 174.62,187.96 174.62,185.5 J6.P$2
SCL  (via drill 0.5, 0.5 pad 0.25, 0.5 pad 0.81)
  Top 0.406: R1.P$2 66.04,96.52 66.67,97.16 75.56,97.16 76.2,97.79 MP.28 76.2,102.23 76.83,102.87 79.38,102.87 80.01,102.23 80.01,96.52 80.64,95.89 127.64,95.89 128.27,96.52 128.27,103.5 128.91,104.14 v134.62,104.14 | v54.61,91.44 54.61,92.08 55.24,92.71 55.24,121.28 54.61,121.92 P3.28 | v38.1,124.46 41.27,124.46 41.91,125.09 v41.91,140.34 | v41.91,142.88 v41.91,154.94 | P4.28 175.26,99.69 175.9,99.06 180.34,99.06 180.97,98.42 v180.97,50.8 | P4.28 175.26,100.97 | P6.28 175.26,163.83 175.9,163.19 180.34,163.19 180.97,162.56 180.97,100.97 180.34,100.33 P4.28 | v139.7,104.14 174.62,104.14 v175.26,103.5
  Bottom 0.406: R1.P$2 v54.61,91.44 54.61,89.53 53.98,88.9 53.98,79.38 53.34,78.74 38.73,78.74 38.1,78.11 P2.28 | P3.28 v38.1,124.46 | v41.91,140.34 v41.91,142.88 | P1.28 38.1,162.56 38.73,161.93 40.64,161.93 41.27,161.29 41.27,155.57 v41.91,154.94 | P5.28 175.26,50.16 175.9,50.8 v180.97,50.8 | v175.26,103.5 P4.28 | v134.62,104.14 v139.7,104.14
SD6
  Top 0.406: U$26.4 140.97,161.29 142.24,160.02 146.05,160.02 147.32,161.29 147.32,163.83 148.59,165.1 148.59,167.64 152.4,171.45 162.56,171.45 P6.5
SDA  (via drill 0.5)
  Top 0.406: 78.74,97.16 78.11,96.52 68.58,96.52 67.94,95.89 67.94,92.08 68.58,91.44 R2.P$2 | v55.24,88.9 55.24,89.53 55.88,90.17 55.88,122.56 55.24,123.19 36.2,123.19 | P3.27 35.56,122.56 36.2,123.19 | 36.2,123.19 v36.2,124.46 36.2,127.64 36.83,128.27 40.01,128.27 40.64,128.91 v40.64,140.34 | v40.64,142.88 v40.64,154.94 | v179.71,52.07 179.71,97.79 179.07,98.42 173.35,98.42 172.72,99.06 P4.27 172.72,101.6 | 172.72,101.6 173.35,102.23 179.71,102.23 180.34,102.87 180.34,161.93 179.71,162.56 173.35,162.56 172.72,163.19 P6.27 | 78.74,97.16 78.74,95.89 79.38,95.25 128.91,95.25 129.54,95.89 129.54,102.23 130.18,102.87 v134.62,102.87 | 78.74,97.16 MP.27 | v139.7,102.87 140.34,103.5 172.09,103.5 v172.72,102.87 172.72,101.6
  Bottom 0.406: R2.P$2 69.85,89.53 69.22,88.9 v55.24,88.9 54.61,88.27 54.61,78.74 53.98,78.11 39.37,78.11 38.73,77.47 38.73,73.66 39.37,73.03 39.37,70.48 38.73,69.85 36.2,69.85 35.56,70.48 P2.27 | v40.64,140.34 v40.64,142.88 | v40.64,154.94 40.64,160.66 40.01,161.29 36.2,161.29 35.56,161.93 P1.27 | P5.27 172.72,50.8 173.99,52.07 v179.71,52.07 | v134.62,102.87 135.25,103.5 139.06,103.5 v139.7,102.87
SLEEP1_1  (via drill 0.5)
  Top 0.406: P1.24 27.94,167.64 28.57,167 33.66,167 34.29,166.37 v34.29,158.75
  Bottom 0.406: v34.29,158.75 33.66,158.75 33.02,158.12 H1.22
SLEEP1_2  (via drill 0.5)
  Top 0.406: P2.24 27.94,71.12 29.84,69.22 32.38,69.22 34.29,67.31 v34.29,60.33
  Bottom 0.406: v34.29,60.33 33.66,60.33 33.02,59.69 H2.22
SLEEP1_3  (via drill 0.5)
  Top 0.406: P3.24 27.94,120.65 29.21,119.38 33.66,119.38 34.29,118.75 v34.29,109.86
  Bottom 0.406: v34.29,109.86 34.29,108.58 33.02,107.95 H3.22
SLEEP1_4
  Top 0.406: H4.22 170.18,87.63 168.91,88.9 168.91,96.52 167.64,97.79 166.37,97.79 165.1,99.06 P4.24
SLEEP1_5
  Top 0.406: H5.22 170.18,36.83 171.45,38.1 171.45,45.72 170.18,46.99 166.37,46.99 165.1,48.26 P5.24
SR6
  Top 0.406: U$26.1 151.13,165.1 151.13,167.64 153.67,170.18 163.83,170.18 P6.4
V5  (via drill 0.6 pad 1.02, 0.8, 1.2, 1.3)  (1 unrouted)
  Top 0.406: C4_6.1 162.56,176.53 | 162.56,176.53 P6.7 | R1_6.2 172.72,177.8 171.45,176.53 | 171.45,176.53 162.56,176.53 | 171.45,176.53 171.45,171.45 168.91,168.91 156.21,168.91 154.94,167.64 P6.20 154.94,161.29 | R1_1.2 29.21,181.61 28.26,180.66 C1_1.2 23.18,180.66 22.86,180.34 P1.7 22.86,175.26 20.32,172.72 13.97,172.72 11.43,170.18 11.43,166.37 10.48,165.42 C4_1.1 | C7_1.1 21.59,165.42 21.59,169.54 20.95,170.18 19.05,170.18 P1.20 | R1_3.2 31.75,134.62 30.48,133.35 25.72,133.35 C1_3.2 25.4,132.08 P3.7 22.86,127 21.59,125.73 | C4_3.1 10.48,115.25 11.43,114.3 11.43,111.76 12.7,110.49 15.24,110.49 H3.9 17.78,113.67 18.41,114.3 22.23,114.3 22.86,114.94 | 21.59,125.73 21.59,118.11 C7_3.1 22.86,116.52 22.86,114.94 | C7_1.1 21.59,162.24 21.59,161.29 19.05,161.29 H1.9 17.78,160.66 17.14,161.29 11.43,161.29 10.79,161.93 10.79,163.83 | C7_1.1 23.18,162.24 24.13,161.29 28.57,161.29 29.53,162.25 R4_1.1 | R1_2.2 24.45,83.82 C1_2.2 24.13,81.28 P2.7 22.86,76.83 22.23,76.2 19.68,76.2 19.05,75.56 19.05,73.66 | C4_2.1 10.48,64.45 11.43,63.5 11.43,60.96 12.7,59.69 15.24,59.69 H2.9 17.78,63.5 19.05,64.77 21.91,64.77 C7_2.1 23.18,67 24.13,67.94 25.4,67.94 | R1_5.2 161.61,60.96 | 161.61,60.96 C1_5.2 | 161.61,60.96 161.61,58.74 P5.7 160.02,54.61 158.75,53.34 | 158.75,53.34 P5.20 154.94,50.16 154.31,50.8 151.76,50.8 151.13,51.44 151.13,57.78 150.5,58.42 149.22,58.42 148.59,57.78 148.59,55.88 147.96,55.24 138.43,55.24 137.79,54.61 137.79,11.43 138.43,10.79 175.9,10.79 176.53,11.43 E5.4 | C7_5.1 160.34,45.4 158.75,46.99 158.75,53.34 | C4_5.1 147.64,41.59 148.59,40.64 148.59,38.1 149.86,36.83 152.4,36.83 H5.9 154.94,40.64 156.21,41.91 158.75,41.91 160.02,43.18 160.02,44.13 C7_5.1
  Top 0.406: 154.94,161.29 154.94,156.21 153.67,154.94 U$26.8 148.59,145.41 149.22,144.78 JP9.1 | C1_6.2 160.97,160.97 160.02,160.02 156.21,160.02 154.94,161.29 | R1_4.2 162.88,111.76 C1_4.2 162.56,110.49 P4.7 | P4.20 156.21,101.6 158.12,101.6 158.75,100.97 158.75,98.42 160.02,97.16 160.66,97.16 160.97,96.84 C7_4.1 R4_4.1 | R4_2.1 29.21,66.36 29.21,67.31 28.57,67.94 25.4,67.94 | R4_3.1 29.53,115.25 28.57,114.3 23.5,114.3 22.86,114.94 | C7_5.1 160.34,41.59 161.29,40.64 161.29,38.1 161.93,37.47 165.74,37.47 166.37,38.1 166.37,44.13 R4_5.1 | 19.05,73.66 23.5,73.66 24.13,73.03 24.13,69.22 25.4,67.94 | 21.59,125.73 P3.20 | C4_M.1 106.36,88.58 107.31,87.63 107.31,80.64 106.68,80.01 86.36,80.01 | 86.36,80.01 70.48,80.01 69.85,80.64 R2.P$1 | 86.36,80.01 87.31,80.96 R1_M.2 87.31,87.94 87.63,88.27 89.86,88.27 C1_M.2 90.48,88.58 91.44,89.53 MP.7 | P2.20 19.05,73.66 | R1_M1.2 96.52,104.14
  Top 0.61: 11.43,24.13 12.06,23.5 27.3,23.5 27.94,24.13 | 27.94,24.13 28.57,23.5 43.81,23.5 44.45,24.13 E1.4 | 27.94,24.13 E3.4 | P4.20 154.94,98.42 154.31,97.79 147.32,97.79 146.69,97.16 146.69,95.56 C4_4.1 146.69,94.94 146.69,92.71 147.32,92.08 154.31,92.08 154.94,91.44 H4.9 | 170.81,112.08 R1_4.2 | E2.4 11.43,24.13 | 11.43,24.13 10.79,23.5 v1.91,23.5 | R2.P$1 R1.P$1 64.77,83.82 64.14,84.45 64.14,100.97 64.77,101.6 67.31,101.6 67.94,102.23 67.94,105.92 C10.1 | C10.1 69.85,106.68 71.12,105.41 Q3.1 | MP.20 96.52,104.14 96.52,109.22 95.89,109.86 72.39,109.86 71.75,109.22 71.75,108.58 71.12,107.95 69.98,107.95 C10.1
  Top 0.813: v1.91,94.61 v48.9,94.61 | v132.08,92.71 135.25,92.71 135.89,93.34 v135.89,109.86 v130.81,109.86 | U$26.8 148.59,152.4 147.96,151.76 123.19,151.76 122.87,151.44 122.87,126.05 123.83,125.09 123.83,110.49 124.46,109.86 v126.36,109.86
  Top 1.016: JP15.2 JP14.2 114.3,87.63 115.57,88.9 120.02,88.9 120.65,89.53 v120.65,92.08 | v120.65,101.6 v120.65,118.11
  Top 1.27: 122.87,126.05 v120.02,126.05 112.08,126.05 111.76,125.73 111.76,123.83 111.44,123.51 CV4.1 105.09,123.51 Q5.3 | v74.93,118.11 67.94,118.11 67.31,117.47 67.31,108.58 67.94,107.95 69.72,107.95 C10.1
  Bottom 0.406: 69.85,107.95 C10.1 | P4.7 160.02,106.68 159.38,106.05 155.57,106.05 154.94,105.41 P4.20 | JP9.1 JP10.1 JP11.1 JP12.1 JP13.1 JP9.1
  Bottom 0.61: P2.20 17.78,74.3 17.14,74.93 1.91,74.93 | P3.20 17.78,122.56 17.14,123.19 1.91,123.19 1.91,157.48 2.54,158.12 17.14,158.12 17.78,158.75 H1.9
  Bottom 0.813: v48.9,94.61 64.77,94.61 65.41,95.25 65.41,107.31 66.04,107.95 69.85,107.95 | v135.89,109.86 158.75,109.86 160.02,108.58 P4.7 | v132.08,92.71 132.08,83.82 | 132.08,83.82 132.08,59.69 132.72,59.05 159.38,59.05 160.02,58.42 P5.7 | E4.4 132.08,83.82 | v126.36,109.86 v130.81,109.86
  Bottom 1.016: 1.91,123.19 v1.91,94.61 1.91,74.93 v1.91,23.5 | v120.65,92.08 v120.65,101.6 | v120.65,118.11 120.65,120.02 120.02,120.65 v120.02,126.05
  Bottom 1.27: v74.93,118.11 76.83,120.02 103.5,120.02 104.14,120.65 Q5.3
VIN  (via drill 0.6 pad 1.27, 0.8, 1, 1.1, 1.3)
  Top 0.813: H5.20 C10_5.2 | C10_2.2 H2.20 | v137.79,84.45 137.79,78.11 136.53,76.83 v122.56,76.83 122.56,68.58 123.19,67.94 131.44,67.94 132.08,67.31 132.08,34.92 132.72,34.29 v136.53,34.29 | H4.20 C10_4.2
  Top 1.016: v62.87,85.09 62.87,121.28 63.5,121.92 81.28,121.92 | C10_3.2 H3.20 | v64.14,103.5 64.14,120.02 64.77,120.65 80.64,120.65 81.28,121.28 | C10_1.2 H1.20 | JP8.1 JP7.1 154.94,137.16 156.21,135.89 156.21,128.91 154.94,127.64 v142.24,127.64
  Top 1.27: Q5.1 98.11,123.51 CV3.1 91.75,123.51 91.44,123.83 91.44,127 90.81,127.64 81.92,127.64 81.28,127 JP1.1 | v121.92,123.83 121.92,122.56 121.28,121.92 81.28,121.92 81.28,120.02 121.92,120.02 122.56,119.38 v122.56,99.69 | v122.56,93.34 v122.56,76.83
  Top 2.54: JP1.1 81.28,121.92 81.28,121.28
  Bottom 0.813: H4.20 165.1,83.19 163.83,84.45 v137.79,84.45 | H5.20 165.1,33.66 164.47,34.29 v136.53,34.29
  Bottom 1.016: O6.2 121.92,157.48 121.28,156.84 121.28,129.54 120.65,128.91 81.28,128.91 | H2.20 27.94,52.7 28.57,52.07 40.01,52.07 40.64,52.7 40.64,76.2 41.27,76.83 55.24,76.83 55.88,77.47 55.88,84.45 56.52,85.09 v62.87,85.09 | H3.20 27.94,104.14 28.57,103.5 v64.14,103.5 | 81.28,128.91 62.23,128.91 61.59,129.54 61.59,149.22 60.96,149.86 29.21,149.86 27.94,151.13 H1.20 | 81.28,128.91 81.28,128.27 | v121.92,123.83 125.09,123.83 125.73,124.46 125.73,127 126.36,127.64 v142.24,127.64
  Bottom 1.27: v122.56,99.69 v122.56,93.34
  Bottom 2.54: JP1.1 81.28,128.27

## Text on the board
tNames: Reset | Reset | 6 | Mars Rover 2014 / Arm Board / Rev A / 20140423 / Eric Mullis / Sterling Coffey / Alec Bayliff | 1 | Reset | 2 | 3 | 4 | 5 | Reset | Program | Reset | Reset | 5 | RX TX GND | Reset | 1 | 2 | 3 | 4
bNames: #ROVESOHARD